# EAGLE design PickupWinderSchem (EAGLE 8.0.0)
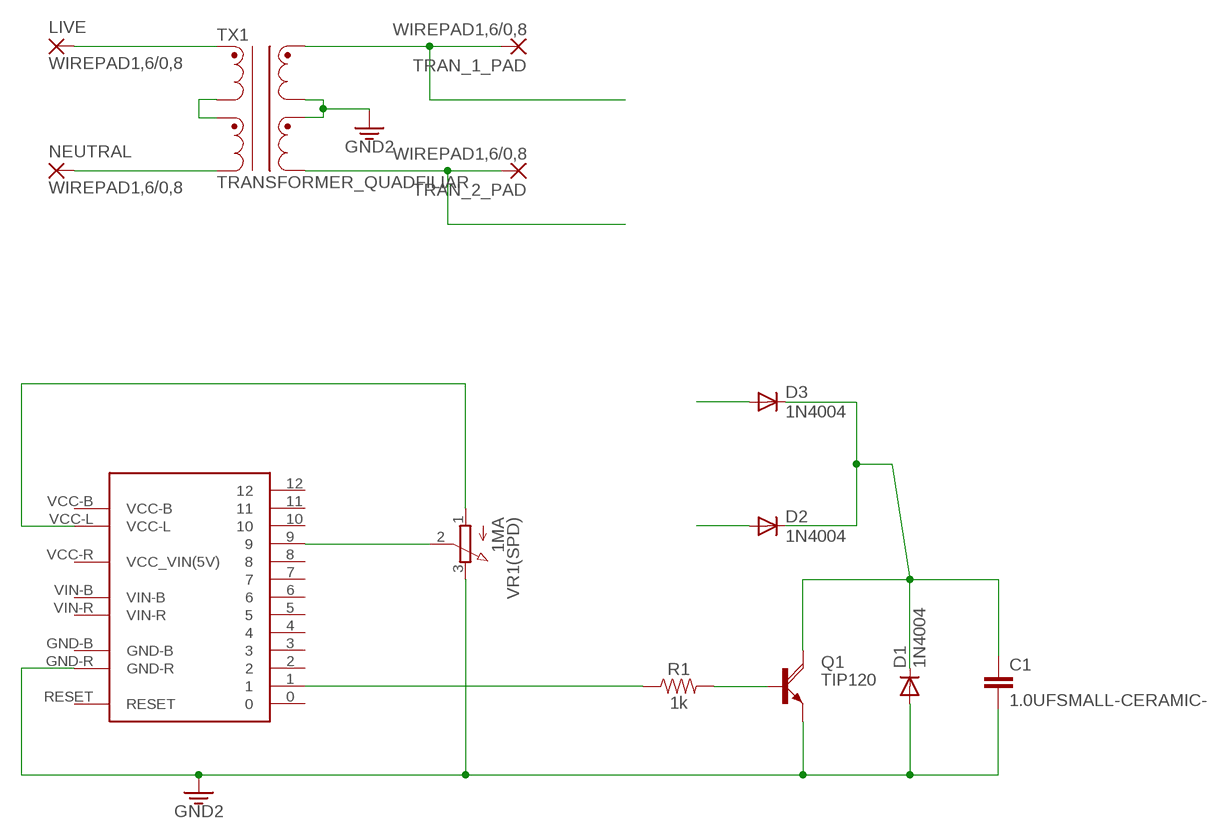
[diagram p0: schematic, sheet 1]

## Parts
C1  1.0UFSMALL-CERAMIC-  [CERAMIC_SML]
D1  1N4004  [DO41-10]
D2  1N4004  [DO41-10]
D3  1N4004  [DO41-10]
LIVE  WIREPAD1,6/0,8  [1,6/0,8]
NEUTRAL  WIREPAD1,6/0,8  [1,6/0,8]
Q1  TIP120  [TO220AH]
R1  1k  1KOHM-HORIZ-1/4W-5%  [AXIAL-0.3]
TRAN_1_PAD  WIREPAD1,6/0,8  [1,6/0,8]
TRAN_2_PAD  WIREPAD1,6/0,8  [1,6/0,8]
TX1  TRANSFORMER_QUADFILIAR  [COILCRAFT_DA230X]
U$1  DIGISPARK_PRO  [DIGISPARK_PRO]
VR1(SPD)  1MA  3RP/1610N  [3RP/1610N]

## Nets
3.3V: C1.P$2 D1.A Q1.E U$1.GND-R VR1(SPD).3(E) ; supply symbol labelled GND2
N$1: R1.P$1 U$1.1
N$2: Q1.B R1.P$2
N$3: U$1.9 VR1(SPD).2(S)
N$4: U$1.VCC-L VR1(SPD).1(A)
N$5: TX1.P$2 TX1.P$3
N$6: TX1.P$6 TX1.P$7 ; supply symbol labelled GND2
N$9: C1.P$1 D1.C D2.C D3.C Q1.C
N$10: LIVE.1(P) TX1.P$4
N$11: NEUTRAL.1(P) TX1.P$1
TRANS_1: D3.A TRAN_1_PAD.1(P) TX1.P$8
TRANS_2: D2.A TRAN_2_PAD.1(P) TX1.P$5
Unconnected: U$1.0 U$1.2 U$1.3 U$1.4 U$1.5 U$1.6 U$1.7 U$1.8 U$1.10 U$1.11 U$1.12 U$1.GND-B U$1.RESET U$1.VCC-B U$1.VCC-R(VCC_VIN(5V)) U$1.VIN-B U$1.VIN-R

## Library data of the parts
C1 = SparkFun-Capacitors:1.0UF: 1µF ceramic capacitors A capacitor is a passive two-terminal electrical component used to store electrical energy temporarily in an electric field.
D1-D3 = diode:1N4004: DIODE general purpose rectifier, 1 A
LIVE NEUTRAL TRAN_1_PAD TRAN_2_PAD = wirepad:WIREPAD: Wire PAD connect wire on PCB
Q1 = transistor-power:TIP120: NPN DARLINGTON TRANSISTOR
R1 = SparkFun-Resistors:1KOHM: 1kΩ resistor A resistor is a passive two-terminal electrical component that implements electrical resistance as a circuit element. Resistors act to reduce current flow, and, at the same time, act to lower voltage levels within circuits. - Wikipedia; PROD_ID: RES-08380
TX1 = SparkFun-Coils:TRANSFORMER_QUADFILIAR: Transformer with 4 independent windings
U$1 = SparkFun-Boards:DIGISPARK_PRO
VR1(SPD) = pot:3RP/1610N: 16mm Potentiometer one level Source: http://www.alphapotentiometers.net/html/16mm_pot_2.html

## Board
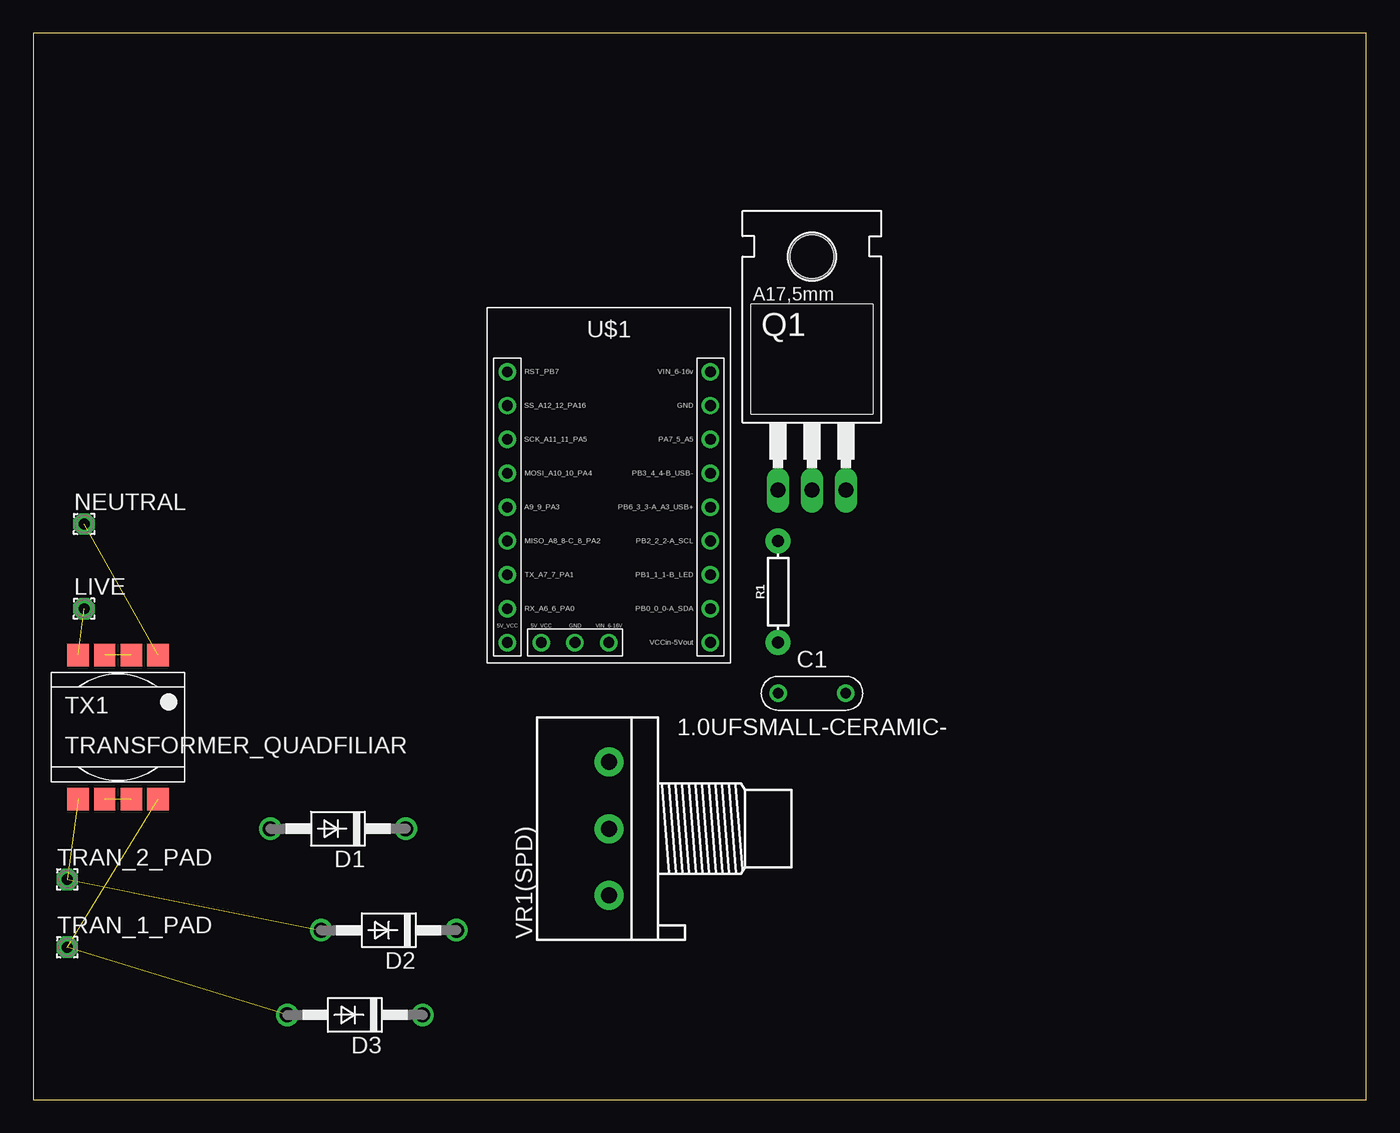
[diagram p1: board, top side]
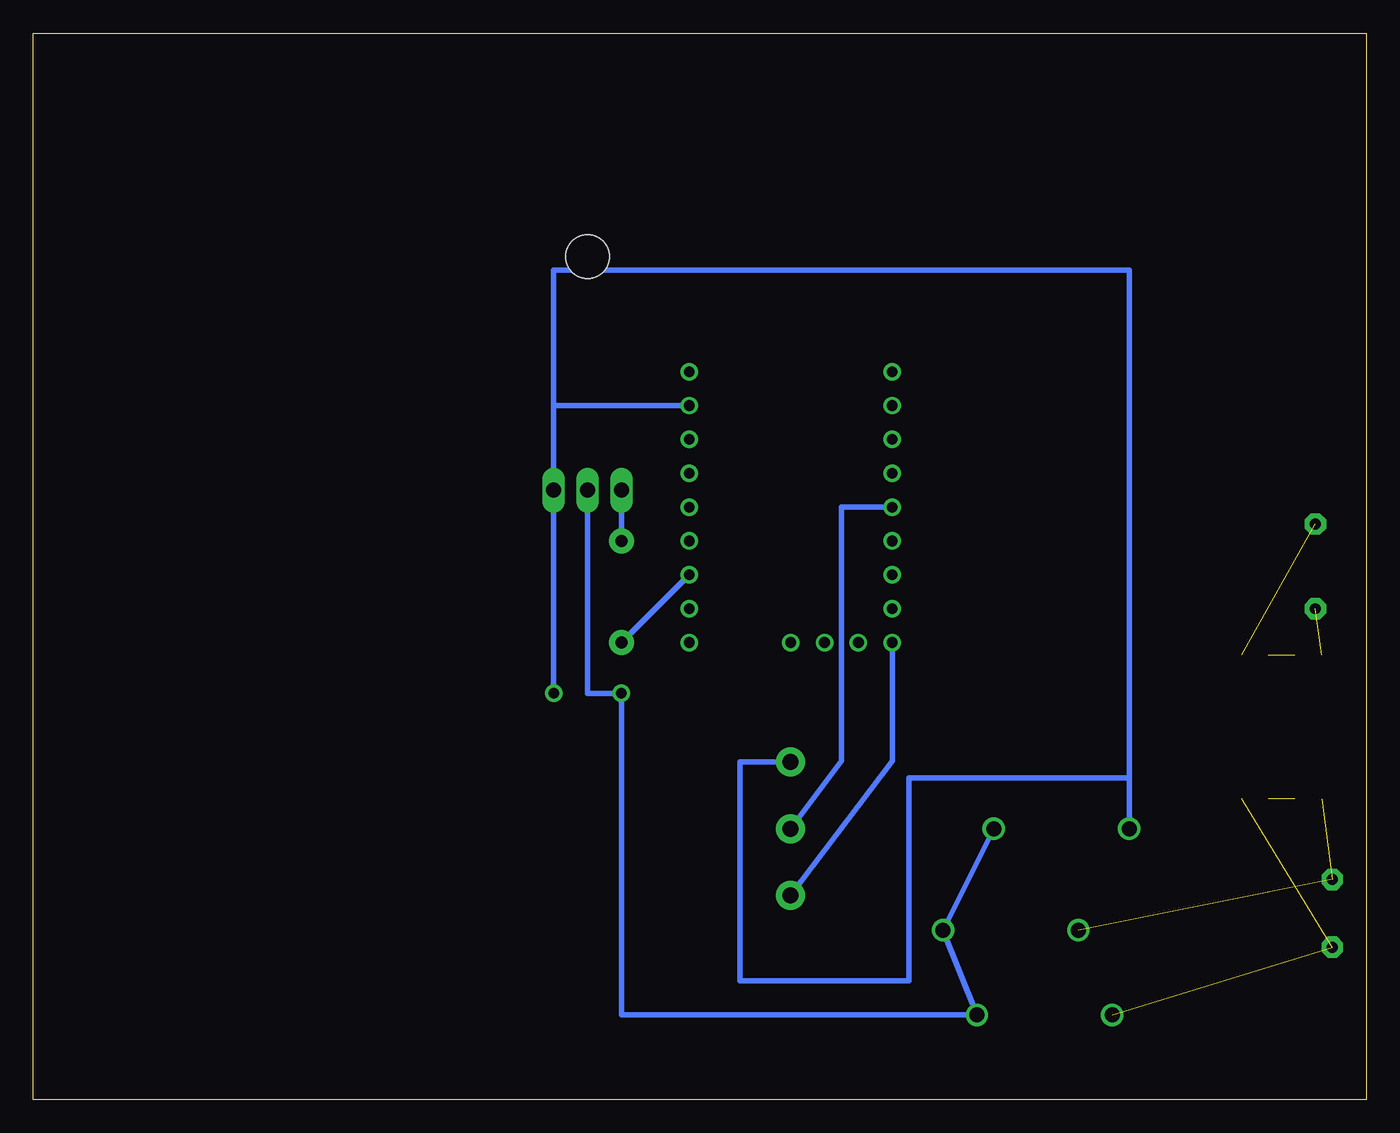
[diagram p2: board, bottom side, seen from below]

Size 100 x 80 mm. Coordinates in mm from the lower left corner, seen from the top.
Outline: 0,0 100,0 100,80 0,80 0,0
Copper layers (1*16): Top 0.035mm / dielectric 1.5mm / Bottom 0.035mm
Design rules "default": minimum track width 10mil, minimum drill 24mil, track to track 8mil, track to pad 8mil, pad to pad 8mil, via to via 8mil, smd to smd 8mil, copper to edge 40mil, drill to drill 8mil, minimum pad ring 10mil, minimum via ring 8mil, stop-mask expansion 4mil, vias tented up to drill 0mil, thermal gap 10mil

### Footprints (pad centres in the part's own frame; a part is rotated, then mirrored left to right if it is on the bottom)
CERAMIC_SML = drill 0.8: P$1 0,0; P$2 5.08,0
DO41-10 = drill 1.118: A 5.08,0; C -5.08,0
1,6/0,8 = drill 0.813 pad 1.6 octagon: 1 0,0
TO220AH = drill 1.118 long: B -2.54,-6.35; C 0,-6.35; E 2.54,-6.35 | hole 3.302: 0,11.176
AXIAL-0.3 = drill 0.9 pad 1.88: P$1 -3.81,0; P$2 3.81,0
COILCRAFT_DA230X = smd 1.7 x 1.6: P$1 -5.4,3; P$2 -5.4,1; P$3 -5.4,-1; P$4 -5.4,-3; P$5 5.4,-3; P$6 5.4,-1; P$7 5.4,1; P$8 5.4,3
DIGISPARK_PRO = drill 0.8: 0 16.51,3.81; 1 16.51,6.35; 2 16.51,8.89; 3 16.51,11.43; 4 16.51,13.97; 5 16.51,16.51; 6 1.27,3.81; 7 1.27,6.35; 8 1.27,8.89; 9 1.27,11.43; 10 1.27,13.97; 11 1.27,16.51; 12 1.27,19.05; GND-B 6.35,1.27; GND-R 16.51,19.05; RESET 1.27,21.59; VCC-B 3.81,1.27; VCC-L 1.27,1.27; VCC-R 16.51,1.27; VIN-B 8.89,1.27; VIN-R 16.51,21.59
3RP/1610N = drill 1.2 pad 2.184: 1 -5,0; 2 0,0; 3 5,0

### Placement (x,y rotation side)
C1  55.88,30.48 0 top
D1  22.86,20.32 180 top
D2  26.67,12.7 180 top
D3  24.13,6.35 180 top
LIVE  3.81,36.83 0 top
NEUTRAL  3.81,43.18 0 top
Q1  58.42,52.07 0 top
R1  55.88,38.1 90 top
TRAN_1_PAD  2.54,11.43 0 top
TRAN_2_PAD  2.54,16.51 0 top
TX1  6.35,27.94 270 top
U$1  34.29,33.02 0 top
VR1(SPD)  43.18,20.32 90 top

### Tracks (layer width: path | path; a pad name or v marks a point on that pad's centre or on a via)
3.3V
  Bottom 0.406: 60.96,52.07 Q1.E 60.96,31.75 C1.P$2 | 60.96,52.07 U$1.GND-R | D1.A 17.78,24.13 | 17.78,24.13 34.29,24.13 34.29,8.89 46.99,8.89 46.99,25.32 VR1(SPD).3 | 17.78,24.13 17.78,62.23 60.96,62.23 60.96,52.07
N$1
  Bottom 0.406: U$1.1 R1.P$1
N$2
  Bottom 0.406: R1.P$2 Q1.B
N$3
  Bottom 0.406: VR1(SPD).2 39.37,25.4 39.37,44.45 U$1.9
N$4
  Bottom 0.406: VR1(SPD).1 35.56,25.4 U$1.VCC-L
N$5  (1 unrouted)
N$6  (1 unrouted)
N$9
  Bottom 0.406: Q1.C 58.42,30.48 C1.P$1 55.88,6.35 D3.C D2.C D1.C
N$10  (1 unrouted)
N$11  (1 unrouted)
TRANS_1  (2 unrouted)
TRANS_2  (2 unrouted)